# EasyEDA Pro project x_terminal.eprj, board PCB_x_terminal_2022-08-23
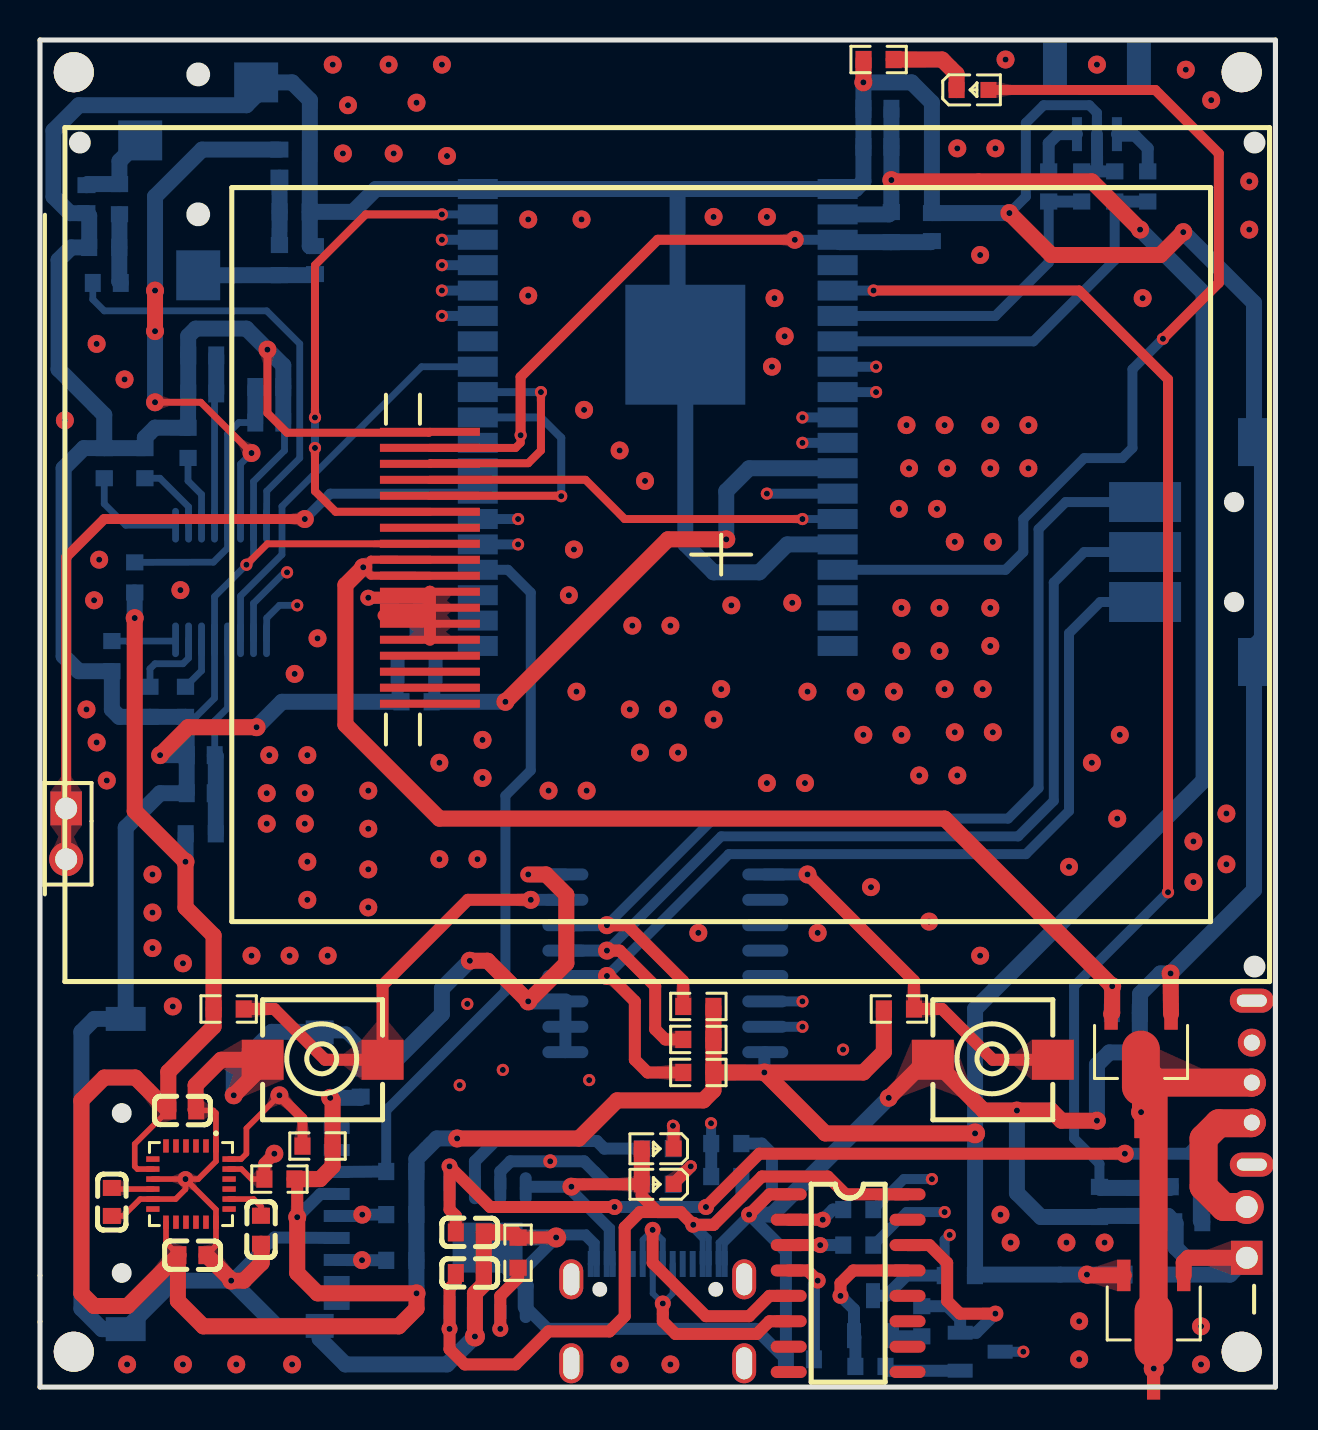
[diagram p2: board, top side]
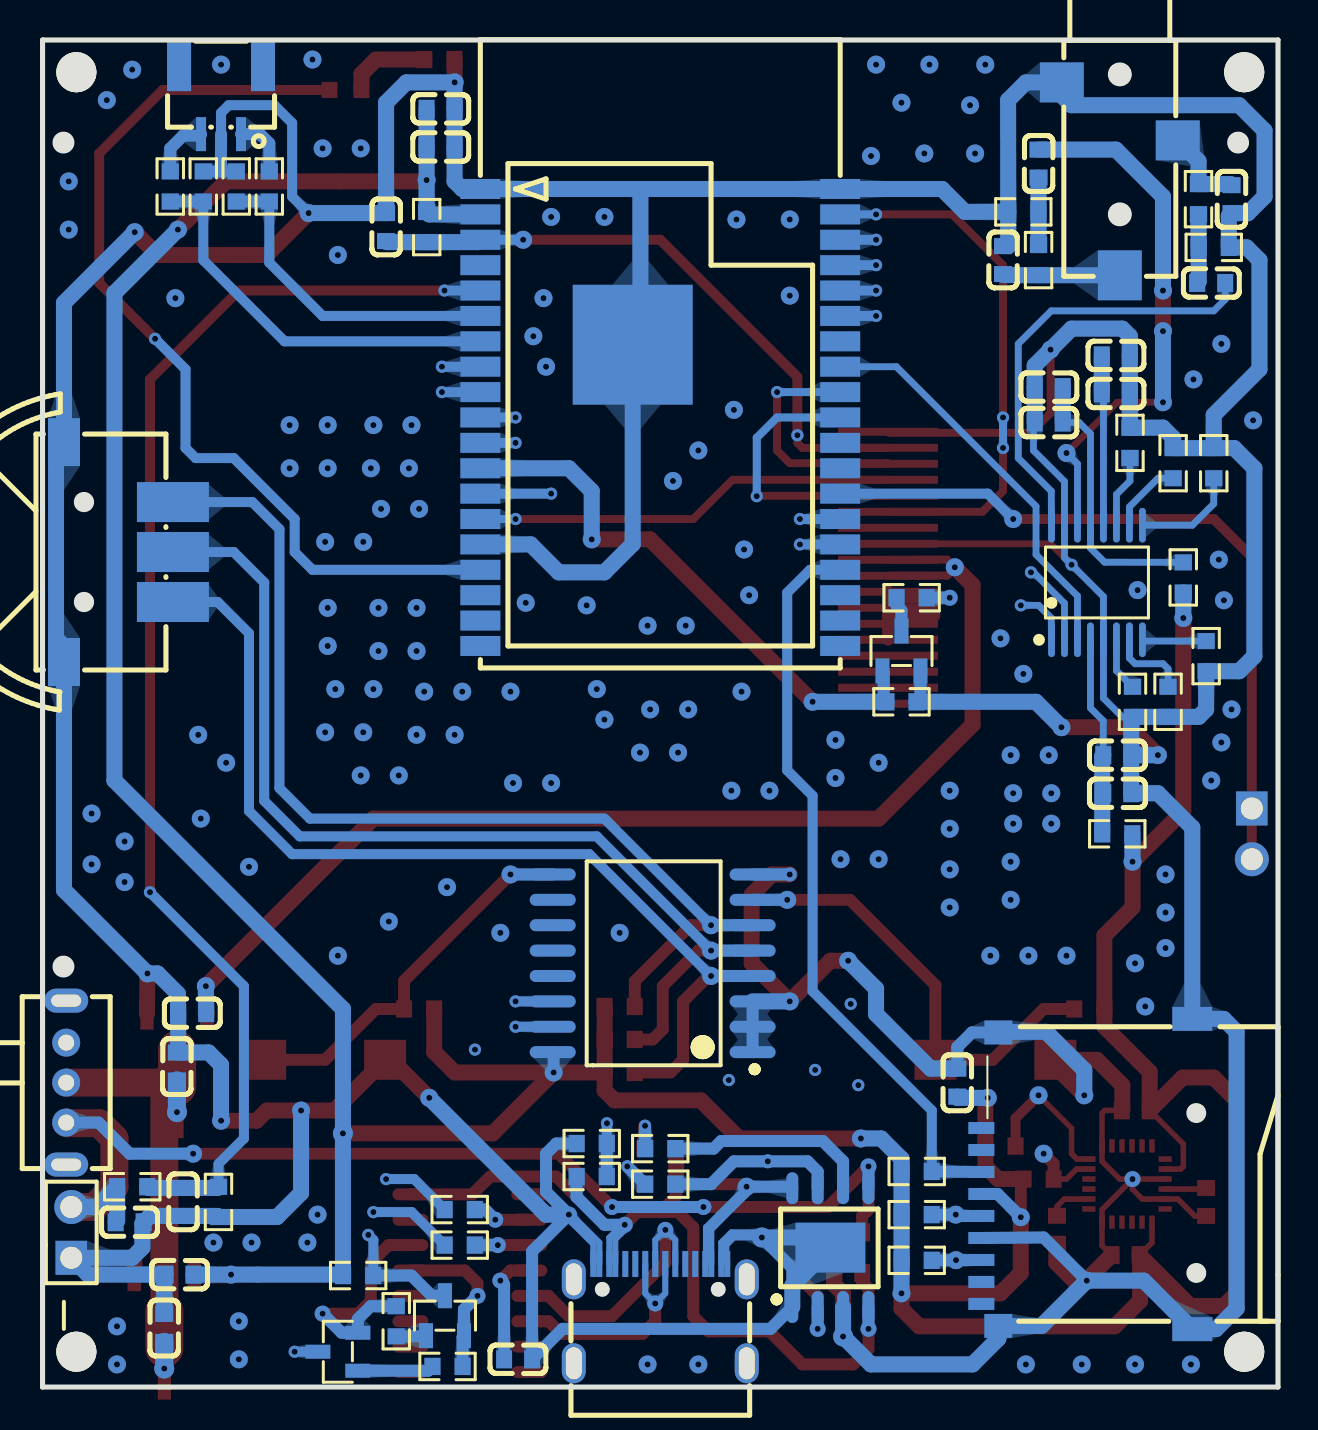
[diagram p3: board, bottom side, seen from below]

Outline 61.8 x 67.39 mm; copper layers: Top Layer, Inner1, Inner2, Bottom Layer. Coordinates in mm from the lower left corner of the outline.
Outline path: 0,3.26 0,5.59 0,67.39 61.8,67.39 61.8,0 0,0 0,3.26
Stack: Top Layer 0.035mm / Dielectric1 0.48mm PP er 4.5 / Inner1 0.035mm / Dielectric2 0.48mm FR4 er 4.5 / Inner2 0.035mm / Dielectric3 0.48mm PP er 4.5 / Bottom Layer 0.035mm

## Design rules (mm)
spacing Default (default): track to track 0.152, other pairs 0 to 0.152
track width Default (default): min 0.254, default 0.254, max 25.4
differential pair differentialPair (default): width min 0.127, default 0.254, max 2.54; gap min 0.152, default 0.152
via Default (default): diameter min 0.61, default 0.61, max 100.025; hole min 0.305, default 0.305, max 59.995
net GND uses gge6577222
pour e872 uses gge6577222

## Placement (name value [footprint] x y rotation side)
C1  100nF  [C0603]  44.62 58.03 270 bottom
C2  100nF  [C0603]  3.6 9.26 90 top
C3  10nF  [C0603]  7.12 13.84 180 top
C4  47uF  [C0603]  8.04 31.61 0 bottom
C5  2.2uF  [C0603]  41.89 62.04 0 bottom
C6  100nF  [C0603]  41.89 63.94 0 bottom
C7  47uF  [C0603]  3.34 55.23 0 bottom
C8  47uF  [C0603]  11.98 61.2 270 bottom
C9  100nF  [C0603]  2.33 59.43 90 bottom
C10  100nF  [C0603]  7.63 6.6 180 top
C12  2.2nF  [C0603]  11.05 7.87 270 top
C13  1uF  [C0603]  55.08 16.04 90 bottom
C14  10uF  [C0603]  16.04 15.23 90 bottom
C15  2.2uF  [C0603]  54.32 18.71 0 bottom
C16  100nF  [C0603]  57.44 8.24 180 bottom
C17  100nF  [C0603]  54.78 9.26 270 bottom
C18  10uF  [C0603]  21.5 5.7 0 top
C19  10uF  [C0603]  21.5 7.74 0 top
C20  1uF  [C0603]  55.71 2.96 90 bottom
C21  2.2uF  [C0603]  54.95 5.62 0 bottom
C22  100nF  [C0603]  38.01 1.39 180 bottom
C23  47uF  [C0603]  11.47 48.25 0 bottom
C30  100nF  [C0603]  8.04 29.71 0 bottom
C31  100nF  [C0603]  11.47 50.03 0 bottom
C33  100nF  [C0603]  8.11 51.61 0 bottom
C34  100nF  [C0603]  8.11 49.7 0 bottom
C37  100nF  [C0603]  13.76 56.38 270 bottom
CARD1  TF-01A  [TF-SMD_TF-01A]  9.56 10.66 90 bottom
CN1  PJ-326-3A  [AUDIO-SMD_PJ-326-3A]  7.91 60.44 180 bottom
CN2  连接器SH卧贴 1.0MM 间距 3P  [CONN-SMD_3P-P1.00_WAFER-SH1.0-3PWB]  52.87 64.38 0 bottom
J1  HDR-M-2.54_1x2  [HDR-M-2.54_1X2]  60.36 7.74 90 bottom
J2  HDR-M-2.54_1x2  [HDR-M-2.54_1X2]  1.31 27.68 270 top
LCD2  TFT_2.4_18P_SPI_ILI9341_240X320_65K_S  [ILI9341-2.4SPI]  34.08 41.65 270 top
LED1  red  [LED0603-RD]  30.9 10.15 180 top
LED2  green  [LED0603-RD]  30.9 11.93 180 top
LED3  green  [LED0603-RD]  46.65 64.89 0 top
NOREF  -  [Pad_e1905]  1.69 65.78 0 top
NOREF#2  -  [Pad_e1906]  60.11 65.78 0 top
NOREF#3  -  [Pad_e1908]  1.69 1.77 0 top
NOREF#4  -  [Pad_e1907]  60.11 1.77 90 top
Q1  S8050_C908252  [SOT-23-3_L2.9-W1.3-P1.90-LS2.4-BR]  47.03 1.77 180 bottom
Q2  S8050_C908252  [SOT-23-3_L2.9-W1.3-P1.90-LS2.4-BR]  41.67 3.57 270 bottom
Q3  S8050_C908252  [SOT-23-3_L2.9-W1.3-P1.90-LS2.4-BR]  18.84 36.82 270 bottom
R1  10K  [R0603]  32.93 15.74 0 top
R2  10K  [R0603]  32.93 17.39 180 top
R3  10K  [R0603]  32.93 19.04 180 top
R4  10K  [R0603]  44.11 3.29 270 bottom
R5  220K  [R0603]  3.21 57.01 0 bottom
R6  100R  [R0603]  3.98 59.43 270 bottom
R7  100  [R0603]  40.93 7.1 180 bottom
R8  100  [R0603]  40.93 8.88 180 bottom
R9  10K  [R0603]  46.01 5.58 180 bottom
R10  10K  [R0603]  18.07 6.34 0 bottom
R11  10K  [R0603]  18.07 10.78 0 bottom
R12  10K  [R0603]  18.07 8.62 0 bottom
R13  10K  [R0603]  41.54 1.03 180 bottom
R14  100k  [R0603]  18.84 34.28 180 bottom
R15  10  [R0603]  18.33 39.49 0 bottom
R16  1K  [R0603]  41.95 66.41 0 top
R17  47K  [R0603]  57.32 10.02 0 bottom
R18  47K  [R0603]  53 9.26 90 bottom
R19  47K  [R0603]  34.33 10.53 0 bottom
R20  47K  [R0603]  34.33 12.18 180 bottom
R21  10K  [R0603]  42.58 58.03 90 bottom
R22  4.7K  [R0603]  11.98 10.4 180 top
R23  4.7K  [R0603]  13.88 12.05 0 top
R24  100K  [R0603]  55.41 60.06 270 bottom
R25  100K  [R0603]  50.46 60.06 270 bottom
R26  20K  [R0603]  52.11 60.06 90 bottom
R27  20K  [R0603]  53.76 60.06 90 bottom
R34  10K  [R0603]  9.44 18.91 180 top
R35  10K  [R0603]  42.97 18.91 180 top
R39  1K  [R0603]  30.9 11.93 0 bottom
R40  1K  [R0603]  30.9 10.15 0 bottom
R41  1.2K  [R0603]  23.92 6.72 270 top
R44  1R  [R0603]  8.04 27.68 0 bottom
R45  1R  [R0603]  4.74 40.5 90 bottom
R46  10K  [R0603]  7.28 34.28 90 bottom
R47  10K  [R0603]  5.5 34.28 90 bottom
R48  10K  [R0603]  3.6 36.57 90 bottom
R49  10K  [R0603]  3.21 46.22 270 bottom
R50  10K  [R0603]  5.25 46.22 270 bottom
R51  10K  [R0603]  7.41 47.23 270 bottom
R53  220K  [R0603]  12.74 58.79 180 bottom
R54  100R  [R0603]  11.98 56.38 90 bottom
SW2  -  [拨轮开关三脚]  59.73 41.77 90 bottom
SW11  K2-1817UQ-C4SW-01  [KEY-SMD_2P-L6.0-W6.0-P6.00]  14.14 16.37 0 top
SW12  K2-1817UQ-C4SW-01  [KEY-SMD_2P-L6.0-W6.0-P6.00]  47.67 16.37 0 top
SW13  SK-12D07-VG3  [SW-TH_SK-12D07-VG3]  60.62 15.23 270 bottom
U1  ESP32-WROVER-I  [WIFIM-SMD_ESP32-WROVER-I]  30.9 48.5 180 bottom
U2  HT7833  [SOT-89_L4.5-W2.5-P1.50-LS4.2-BR]  55.71 4.23 90 top
U3  HT7833  [SOT-89_L4.5-W2.5-P1.50-LS4.2-BR]  55.08 17.31 90 top
U4  MPU-6050_C24112  [QFN-24_L4.0-W4.0-P0.50-BL-MPU-6050]  7.55 10.15 180 top
U7  UDA1334ATS/N2,118  [SSOP-16_L5.0-W4.4-P0.65-LS6.4-BL]  9.06 40.25 180 bottom
U9  PCF8574T  [SOP-16_L10.3-W7.5-P1.27-LS10.4-BL]  31.28 21.2 90 bottom
U10  CH340C  [SOP-16_L10.0-W3.9-P1.27-LS6.0-BL]  40.43 5.2 270 top
U14  TP4056  [SOP-8_EP_150MIL]  22.39 6.97 90 bottom
USBC1  TYPE-C-31-M-12  [USB-C_SMD-TYPE-C-31-M-12]  30.9 3.67 180 bottom

## Footprints (pads in the part's own frame, mm; a bottom-side part is the same pattern mirrored in y, then rotated)
AUDIO-SMD_PJ-326-3A
  rect 2.2x2 smd: 1(-2.9,4.825) 3(2.9,1.925)
  rect 2.2x2.5 smd: 2(0,-4.825)
C0603
  rect 0.8x0.9 smd: 1(-0.7,0) 2(0.7,0)
CONN-SMD_3P-P1.00_WAFER-SH1.0-3PWB
  rect 0.5x1.7 smd: 1(-1,1.7) 2(0,1.7) 3(1,1.7)
  rect 1.2x2.5 smd: 4(-2.1,-1.7) 5(2.1,-1.7)
HDR-M-2.54_1X2
  rect 1.7x1.575 hole 1.1: 1(-1.27,0)
  round 1.7 hole 1.1: 2(1.27,0)
ILI9341-2.4SPI
  rect 0.4x5 smd: 1(-6.14,-14.57) 2(-5.34,-14.57) 3(-4.54,-14.57) 4(-3.74,-14.57) 5(-2.94,-14.57) 6(-2.14,-14.57) 7(-1.34,-14.57) 8(-0.54,-14.57) 9(0.26,-14.57) 10(1.06,-14.57) 11(1.86,-14.57) 12(2.66,-14.57) 13(3.46,-14.57) 14(4.26,-14.57) 15(5.06,-14.57) 16(5.86,-14.57) 17(6.66,-14.57) 18(7.46,-14.57)
KEY-SMD_2P-L6.0-W6.0-P6.00
  rect 2.1x2 smd: 1(-3,0) 2(3,0)
LED0603-RD
  rect 0.8x0.8 smd: 1(-0.799,-0.004) 2(0.799,0.004)
Pad_e1905
  round 2 hole 2: 1(0,0)
Pad_e1906
  round 2 hole 2: 1(0,0)
Pad_e1907
  round 2 hole 2: 1(0,0)
Pad_e1908
  round 2 hole 2: 1(0,0)
QFN-24_L4.0-W4.0-P0.50-BL-MPU-6050
  rect 0.28x0.665 smd: 1(-1.25,-1.907) 2(-0.75,-1.907) 3(-0.25,-1.907) 4(0.25,-1.907) 5(0.75,-1.907) 6(1.25,-1.907) 13(1.25,1.907) 14(0.75,1.907) 15(0.25,1.907) 16(-0.25,1.907) 17(-0.75,1.907) 18(-1.25,1.907)
  rect 0.665x0.28 smd: 7(1.907,-1.25) 8(1.907,-0.75) 9(1.907,-0.25) 10(1.907,0.25) 11(1.907,0.75) 12(1.907,1.25) 19(-1.907,1.25) 20(-1.907,0.75) 21(-1.907,0.25) 22(-1.907,-0.25) 23(-1.907,-0.75) 24(-1.907,-1.25)
R0603
  rect 0.806x0.864 smd: 1(-0.753,0) 2(0.753,0)
SOP-8_EP_150MIL
  oval 1.6x0.6 smd: 1(-2.972,1.905) 2(-2.972,0.635) 3(-2.972,-0.635) 4(-2.972,-1.905) 5(2.972,-1.905) 6(2.972,-0.635) 7(2.972,0.635) 8(2.972,1.905)
  rect 2.5x3.5 smd: 9(0,0)
SOP-16_L10.0-W3.9-P1.27-LS6.0-BL
  oval 0.6x1.8 smd: 1(-4.445,-2.972) 2(-3.175,-2.972) 3(-1.905,-2.972) 4(-0.635,-2.972) 5(0.635,-2.972) 6(1.905,-2.972) 7(3.175,-2.972) 8(4.445,-2.972) 9(4.445,2.972) 10(3.175,2.972) 11(1.905,2.972) 12(0.635,2.972) 13(-0.635,2.972) 14(-1.905,2.972) 15(-3.175,2.972) 16(-4.445,2.972)
SOP-16_L10.3-W7.5-P1.27-LS10.4-BL
  oval 0.6x2.3 smd: 1(-4.445,-5) 2(-3.175,-5) 3(-1.905,-5) 4(-0.635,-5) 5(0.635,-5) 6(1.905,-5) 7(3.175,-5) 8(4.445,-5) 9(4.445,5) 10(3.175,5) 11(1.905,5) 12(0.635,5) 13(-0.635,5) 14(-1.905,5) 15(-3.175,5) 16(-4.445,5)
SOT-23-3_L2.9-W1.3-P1.90-LS2.4-BR
  rect 1.25x0.7 smd: 1(1,-0.95) 2(1,0.95) 3(-1,0)
SOT-89_L4.5-W2.5-P1.50-LS4.2-BR
  rect 1.575x0.672 smd: 1(1.357,-1.5) 3(1.357,1.5)
  custom 5.377x1.9 smd: 2(-1.356,0.009)
SSOP-16_L5.0-W4.4-P0.65-LS6.4-BL
  oval 0.343x1.732 smd: 1(-2.275,-2.866) 2(-1.625,-2.866) 3(-0.975,-2.866) 4(-0.325,-2.866) 5(0.325,-2.866) 6(0.975,-2.866) 7(1.625,-2.866) 8(2.275,-2.866) 9(2.275,2.865) 10(1.625,2.865) 11(0.975,2.865) 12(0.325,2.865) 13(-0.325,2.865) 14(-0.975,2.865) 15(-1.625,2.865) 16(-2.275,2.865)
SW-TH_SK-12D07-VG3
  round 1.4 hole 0.8: 1(-2,0) 2(0,0) 3(2,0)
  oval 1.2x2.2 hole 0.6x1.5: 4(4.1,0) 5(-4.1,0)
TF-SMD_TF-01A
  rect 0.6x1.3 smd: 1(2.3,5.276) 2(1.2,5.276) 3(0.101,5.276) 4(-1,5.276) 5(-2.099,5.276) 6(-3.2,5.276) 7(-4.3,5.276) 8(-5.399,5.276) 9(-6.5,5.276)
  rect 1.2x1.4 smd: 10(-7.599,4.426) 13(7.081,4.426)
  rect 1.2x2 smd: 11(-7.76,-5.276) 12(7.76,-5.276)
USB-C_SMD-TYPE-C-31-M-12
  oval 1.2x2 hole 0.8x1.6: 0(4.325,-2.484) 1(4.325,1.716) 2(-4.325,1.716) 3(-4.325,-2.484)
  rect 0.3x1.3 smd: A1(-3.35,2.484) A4(-2.55,2.484) A5(-1.25,2.484) A6(-0.25,2.484) A7(0.25,2.484) A8(1.25,2.484) A9(2.55,2.484) A12(3.35,2.484) B1(3.05,2.484) B4(2.25,2.484) B5(1.75,2.484) B6(0.75,2.484) B7(-0.75,2.484) B8(-1.75,2.484) B9(-2.25,2.484) B12(-3.05,2.484)
WIFIM-SMD_ESP32-WROVER-I
  rect 2x1 smd: 1(-9,11.43) 2(-9,10.16) 3(-9,8.89) 4(-9,7.62) 5(-9,6.35) 6(-9,5.08) 7(-9,3.81) 8(-9,2.54) 9(-9,1.27) 10(-9,0) 11(-9,-1.27) 12(-9,-2.54) 13(-9,-3.81) 14(-9,-5.08) 15(-9,-6.35) 16(-9,-7.62) 17(-9,-8.89) 18(-9,-10.16) 19(-9,-11.43) 20(9,-11.43) 21(9,-10.16) 22(9,-8.89) 23(9,-7.62) 24(9,-6.35) 25(9,-5.08) 26(9,-3.81) 27(9,-2.54) 28(9,-1.27) 29(9,0) 30(9,1.27) 31(9,2.54) 32(9,3.81) 33(9,5.08) 34(9,6.35) 35(9,7.62) 36(9,8.89) 37(9,10.16) 38(9,11.43)
  rect 6x6 smd: 39(-1.38,3.64)
拨轮开关三脚
  rect 2x3.6 smd: 1(-2.5,-4.45) 2(0,-4.45) 3(2.5,-4.45)
  rect 2.4x1.6 smd: 4(-5.5,1) 5(5.5,1)

## Nets
3V3: C3.2 C5.2 C6.2 C10.2 C14.1 C21.1 CARD1.4 R1.2 R2.1 R3.1 R9.1 R10.2 R11.2 R12.2 R21.2 R22.1 R23.2 R34.2 R35.2 R44.1 R45.1 U1.2 U2.3 U4.8 U4.13 U9.16
3V3_LCD: C15.1 LCD2.9 LCD2.10 U3.3
GND: C1.1 C2.1 C3.1 C4.1 C5.1 C6.1 C9.1 C10.1 C12.2 C13.2 C14.2 C15.2 C16.2 C17.2 C18.2 C19.2 C20.2 C21.2 C22.2 C23.2 C30.1 C31.2 C33.1 C34.1 C37.1 CARD1.6 CARD1.10 CARD1.11 CARD1.12 CARD1.13 CN1.1 CN2.2 J1.1 LCD2.1 LCD2.8 Q3.2 R5.1 R14.2 R16.1 R18.1 R20.1 R26.2 R27.2 R41.1 R46.1 R47.1 R48.1 R49.1 R50.1 R51.1 R53.1 SW2.4 SW2.5 SW11.1 SW12.1 U1.1 U1.15 U1.38 U1.39 U2.1 U3.1 U4.1 U4.9 U4.11 U4.18 U7.5 U7.15 U9.1 U9.2 U9.3 U9.8 U10.1 U14.1 U14.3 U14.9 USBC1.A1 USBC1.A12 USBC1.B1 USBC1.B12
VBAT_S: C17.1 R17.1 R18.2 U1.5
VIN: C13.1 C20.1 SW13.2 U2.2 U3.2
ADC1_CH6: R25.2 R26.1 U1.6
ADC1_CH7: R24.2 R27.1 U1.7
BACK_KEY: R35.1 SW12.2 U9.9
C34_2: C33.2 C34.2 U7.12
CHRG_STAT: R40.1 U1.9 U14.7
D+: U10.5 USBC1.A6 USBC1.B6
D-: U10.6 USBC1.A7 USBC1.B7
DOWN_KEY: R3.2 SW2.3 U9.6
DTR: Q2.2 R13.2 U10.13
I2C_SCL: R22.2 U1.36 U4.23 U9.14
I2C_SDA: R23.1 U1.33 U4.24 U9.15
I2S_BCK: U1.11 U7.1
I2S_DIN: U1.31 U7.3
I2S_LCK: U1.10 U7.2
IO0: Q2.3 R9.2 U1.25
LCD_BCKL: Q3.1 R14.1 U1.12
LCD_CS: LCD2.5 U1.29
LCD_DC: LCD2.4 U1.14
LCD_MOSI: LCD2.6 U1.37
LCD_SCK: LCD2.3 U1.30
LDAC: C37.2 CN1.2 R54.1
LED1_1: LED1.1 R40.2
LED2_1: LED2.1 R39.2
LED3_2: LED3.2 U1.16
MENU_KEY: R34.1 SW11.2 U9.7
Q1_1: Q1.1 R13.1
Q2_1: Q2.1 R4.2
Q3_3: Q3.3 R15.2
R5_2: C7.2 R5.2 R6.2
R7_2: R7.2 U10.3
R8_2: R8.2 U10.2
R15_1: LCD2.11 LCD2.12 LCD2.13 LCD2.14 R15.1
R16_2: LED3.1 R16.2
R24_1: CN2.3 R24.1
R25_1: CN2.1 R25.1
R39_1: R39.1 U14.6
R41_2: R41.2 U14.2
R44_2: C4.2 C30.2 R44.2 U7.4
R45_2: C23.1 C31.1 R45.2 U7.13
R46_2: R46.2 U7.6
R47_2: R47.2 U7.7
R48_2: R48.2 U7.8
R49_2: R49.2 U7.9
R50_2: R50.2 U7.10
R51_2: R51.2 U7.11
R54_2: C8.2 R53.2 R54.2
RDAC: C9.2 CN1.3 R6.1
RESET: C1.2 LCD2.2 Q1.3 R21.1 U1.3
RTS: Q1.2 R4.1 U10.14
RX: R7.1 U1.35
SD_CLK: CARD1.5 R12.1 U1.13
SD_CMD: CARD1.3 R11.1 U1.23
SD_DAT0: CARD1.7 R10.1 U1.24
SELECT_KEY: R2.2 SW2.2 U9.5
TOUCH_SWITCH: J2.1 J2.2 U1.26
TX: R8.1 U1.34
U4_10: C2.2 U4.10
U4_20: C12.1 U4.20
U7_14: C8.1 U7.14
U7_16: C7.1 U7.16
U10_4: C22.1 U10.4
UP_KEY: R1.1 SW2.1 U9.4
USB_DET: R19.1 R20.2 U1.8
V_BATT: C16.1 C19.1 J1.2 R17.2 SW13.3 U14.5
V_USB: C18.1 LED1.2 LED2.2 R19.2 U10.16 U14.4 U14.8 USBC1.A4 USBC1.A9 USBC1.B4 USBC1.B9

Pads without a net: CARD1 1 2 8 9; CN2 4 5; LCD2 7 15 16 17 18; NOREF 1; NOREF#2 1; NOREF#3 1; NOREF#4 1; SW13 1 4 5; U1 4 17 18 19 20 21 22 27 28 32; U4 2 3 4 5 6 7 12 14 15 16 17 19 21 22; U9 10 11 12 13; U10 7 8 9 10 11 12 15; USBC1 0 1 2 3 A5 A8 B5 B8

## Via types
v1: diameter 0.9, hole 0.305, Top Layer to Bottom Layer, 183 vias
v2: diameter 0.7, hole 0.305, Top Layer to Bottom Layer, 2 vias
v3: diameter 0.8, hole 0.305, Top Layer to Bottom Layer, 16 vias
v4: diameter 1, hole 0.305, Top Layer to Bottom Layer, 5 vias
v5: diameter 0.61, hole 0.305, Top Layer to Bottom Layer, 38 vias

## Routing (per net, layer and track width the routed paths; a pad name or vN(x,y) marks a point on that pad's centre or on a via; arc(x,y) is an arc through that point)
3V3: length 234.5
  Top Layer w0.28: C10.2 6.3,7.22 6.3,8.25 ; U4.8 4.87,10.9 4.74,11.04 4.74,12.16 C3.2
  Top Layer w0.6: R22.1 12.87,10.27 v1(12.87,8.5)
  Top Layer w0.8: v1(36.23,15.74) 41.19,15.74 42.21,16.76 R35.2 ; v1(36.23,15.74) R1.2 ; v1(36.23,15.74) 39.28,12.69 v4(46.78,12.69) ; R1.2 R2.1 R3.1 ; R1.2 33.69,14.84 33.19,14.34 28.87,14.34 26.96,12.44 v1(20.87,12.44) ; 42.59,60.38 42.65,60.31 52.62,60.31 v1(55.03,57.9) ; 12.73,10.4 14.01,10.4 14.64,11.05 R23.2 14.64,14.35 v1(14.52,14.47) ; U2.3 52.41,5.58 v1(52.37,5.62) ; v1(4.74,38.47) 4.74,28.82 v1(7.28,26.28) 7.28,23.99 8.68,22.59 8.68,18.03 6.42,15.77 6.42,13.84 4.77,15.48 3.21,15.48 2.07,14.34 2.07,4.69 2.71,4.05 4.38,4.05 C10.2 6.9,6.57 6.9,4.31 8.17,3.04 17.95,3.04 18.84,3.93 v1(18.84,4.69) 13.88,4.69 12.87,5.7 v1(12.87,8.5)
  Bottom Layer w0.6: v1(12.87,8.5) 14.03,9.66 14.84,9.66 ; 36.28,16.75 36.23,16.71 v1(36.23,15.74)
  Bottom Layer w0.8: 42.59,62.04 v1(42.59,60.38) R21.2 42.47,58.66 39.9,58.66 ; 46.78,5.58 v4(46.78,12.69) 46.78,18.91 58.21,30.34 58.21,54.73 v1(55.03,57.9) ; v1(52.37,5.62) C21.1 ; v1(14.52,14.47) 16.04,14.47 C14.1 ; v1(20.87,12.44) 19.85,12.44 18.83,11.41 18.83,10.78 ; R45.1 v1(4.74,38.47) ; R11.2 R10.2 ; R44.1 v1(7.28,26.28) ; 52.37,5.63 46.81,5.63 46.77,5.58 ; C6.2 C5.2 ; 18.83,6.34 v1(18.84,4.69)
3V3_LCD: length 61.8
  Top Layer w0.4: 19.51,41.39 16.55,41.39 v1(16.17,41.01) 16.55,40.59 19.51,40.59
  Top Layer w0.8: v1(16.17,41.01) 15.28,40.12 15.28,33.14 19.98,28.44 45.25,28.44 v1(53.63,20.06) 53.63,18.72 U3.3
  Bottom Layer w0.8: C15.1 v1(53.63,20.06)
GND: length 528.2
  Top Layer w0.28: v3(7.28,10.4) 7.28,9.9 6.79,9.4 U4.11 5.01,9.41 4.16,8.56 3.6,8.56 ; v3(7.28,10.4) 8.8,8.88 8.8,7.08 C10.1 ; v3(7.28,10.4) 7.91,10.4 8.8,11.29 U4.1 8.8,13.7 8.67,13.84 C3.1 ; v3(7.28,10.4) 5.65,10.41
  Top Layer w0.34: v5(10.33,41.14) 11.38,42.19 19.51,42.19
  Top Layer w0.4: v1(11.38,51.9) 11.38,48.72 12.36,47.74 19.46,47.74 19.51,47.79
  Top Layer w0.6: U10.1 36.49,9.64 v3(35.47,8.62) ; R41.1 v4(25.82,7.48)
  Top Layer w0.8: 21.76,2.91 21.76,4.69 22.2,5.13 C18.2 C19.2 23.65,7.74 R41.1 ; v1(52.87,13.32) 51.09,13.32 50.59,13.83 v1(48.87,13.83) 47.2,13.83 SW12.1 44.36,16.37 v1(42.46,14.47) ; v1(10.83,33.01) 7.41,33.01 v1(6.01,31.61) ; 56.58,18.67 v1(56.55,20.69) ; C3.1 7.79,13.87 7.79,15.1 9.06,16.37 SW11.1 11.14,16.04 v1(9.69,14.59) ; v1(48.49,58.73) 50.59,56.63 56.05,56.63 v1(57.19,57.77) ; v2(24.42,25.64) 25.31,25.64 26.33,24.63 26.33,21.2 v1(24.42,19.29) 22.39,21.33 v1(21.5,21.33) ; 41.2,66.41 v1(41.19,65.27) ; C10.1 9.56,5.36 v1(9.56,5.32) 10.2,5.32 11.09,6.21 11.09,7.13 11.05,7.17 ; J1.1 57.44,6.47 57.21,6.24 U2.1
  Bottom Layer w0.3: USBC1.B1 27.85,7.23 27.34,7.74 26.08,7.74 v4(25.82,7.48) 27.22,7.48 27.6,7.1 27.6,6.2 USBC1.A12 ; USBC1.A1 34.25,7.15 35.47,8.37 v3(35.47,8.62) 35.35,8.62 33.95,7.23 USBC1.B12
  Bottom Layer w0.34: 12.17,48.25 12.23,48.19 12.23,46.85 10.68,45.3 10.68,41.49 v5(10.33,41.14) 8.73,39.54 8.73,34.46 7.79,33.52 7.28,33.52
  Bottom Layer w0.5: CN2.2 52.87,63.74 52.49,64.12 50.2,64.12 49.32,63.23 49.32,59.55 v1(48.49,58.73)
  Bottom Layer w0.6: v4(25.82,7.48) 24.3,5.96 U14.1 25.39,2.91 35.79,2.91 C22.2 37.31,6.78 v3(35.47,8.62) 36.62,9.77 36.62,11.67 36.11,12.18 35.08,12.18 ; Q3.2 17.89,34.48 R14.2 ; 14.84,7.46 11.72,7.48 v1(9.56,5.32) ; U9.3 26.28,16.75 ; 52.87,62.68 52.88,60.81 ; R26.2 R27.2 ; 13.99,17.74 15.31,17.74 16.04,17.01 16.04,15.93 ; U9.8 v2(24.42,25.64)
  Bottom Layer w0.8: v1(24.42,19.29) U9.3 ; v1(6.01,31.61) C4.1 ; C14.2 17.38,15.93 20.11,18.66 20.11,19.93 v1(21.5,21.33) ; C31.2 C23.2 ; v4(25.82,7.48) 22.9,7.48 U14.9 24.3,5.07 U14.1 ; R14.2 12.11,34.28 v1(10.83,33.01) ; 3.6,35.81 1.94,35.81 1.18,36.57 1.18,45.96 2.19,46.97 3.21,46.97 ; v3(35.47,8.62) 36.62,8.62 v1(42.46,14.47) ; 55.65,5.63 59.52,5.63 J1.1 57.32,6.47 56.81,6.97 56.81,8.18 56.74,8.24 ; v1(48.49,58.73) C1.1 44.62,64.25 43.6,65.27 v1(41.19,65.27) C6.1 C5.1 ; C16.2 56.43,8.56 C17.2 53.05,8.56 R18.1 50.07,8.51 48.87,9.71 v1(48.87,13.83) ; R53.1 15.66,58.79 16.8,59.93 U1.38 U1.1 40.81,59.93 41.19,60.32 41.19,62.04 ; 55.02,18.71 55.03,19.67 56.05,20.69 v1(56.55,20.69) 60.73,24.87 SW2.4 ; v1(57.19,57.77) 60.73,54.23 SW2.5 ; v1(9.69,14.59) 9.69,15.86 11.6,17.77 13.96,17.77 CARD1.13 ; 5.25,46.97 5.25,47.49 5.75,48 7.41,47.99 7.41,49.7 ; C20.2 55.71,5.56 55.65,5.62 ; 31.9,59.93 31.9,52.53 U1.39 32.28,42.17 33.7,40.76 35.98,40.76 37.38,42.15 U1.15 ; 60.73,47.27 61.13,46.88 61.13,37.45 60.73,37.06 60.73,36.27 ; C33.1 C34.1 ; 7.41,51.61 7.41,52.57 7.79,52.95 10.33,52.95 v1(11.38,51.9) 12.17,51.1 12.17,50.03 ; U14.3 v4(21.76,2.53) 20.36,1.13 15.28,1.13 13.99,2.42 CARD1.10 11.83,3.06 v1(9.56,5.32) 6.71,5.32 CARD1.11 ; 13.76,57.08 13.49,57.08 13.49,58.79 13.5,64.38 12.61,65.27 10.81,65.27 10.81,64.61 10.33,64.12 1.94,64.12 0.67,62.85 0.67,59.55 1.5,58.72 C9.1 2.46,58.59 R5.1 1.56,57.01 0.93,56.38 0.93,50.92 3.21,48.63 R49.1 R50.1 ; v1(52.87,13.32) 52.87,16.12 53.49,16.74 C13.2 55.02,16.8 C15.2 ; R48.1 3.6,33.9 3.97,33.53 R47.1 R46.1 7.34,33.46 C30.1 6.01,29.71 4.29,27.99 4.29,18.42 2.72,18.42 2.07,17.77 2.07,3.93 3.1,2.9 4.29,2.9
  vias: v1(1.25,48.36) v1(2.33,33.9) v1(2.71,39.36) v1(2.83,52.19) v1(2.83,32.25) v1(2.96,41.39) v1(3.34,30.34) v1(4.23,50.41) v1(4.36,1.13) v1(5.63,25.64) v1(5.63,23.74) v1(5.63,21.96) v1(6.64,19.04) v1(7.02,39.87) v1(7.15,21.2) v1(7.15,1.13) v1(9.82,1.13) v1(10.58,21.58) v1(11.34,29.71) v1(11.34,28.18) v1(11.47,31.61) v1(12.49,21.58) v1(12.61,1.13) v1(12.74,35.68) v1(13.25,29.71) v1(13.25,28.18) v1(13.37,31.61) v1(13.37,26.28) v1(13.37,24.37) v1(13.88,37.45) v1(14.39,21.58) v1(14.64,66.16) v1(15.15,61.71) v1(15.41,64.12) v1(16.42,29.83) v1(16.42,27.93) v1(16.42,25.9) v1(16.42,23.99) v1(17.44,66.16) v1(17.69,61.71) v1(18.84,64.25) v1(19.98,31.23) v1(19.98,26.41) v1(20.11,66.16) v1(20.36,61.58) v1(21.88,26.41) v1(22.14,32.37) v1(22.14,30.47) v1(24.42,58.41) v1(24.42,54.6) v1(25.44,29.83) v1(26.46,39.61) v1(26.71,41.9) v1(26.84,34.79) v1(27.09,58.41) v1(27.22,48.88) v1(27.34,29.83) v1(29,46.85) v1(29,1.13) v1(29.5,33.9) v1(29.63,38.09) v1(30.01,31.74) v1(30.27,45.33) v1(31.41,33.9) v1(31.54,38.09) v1(31.54,1.13) v1(31.92,31.74) v1(32.93,22.72) v1(33.7,58.54) v1(33.7,33.39) v1(34.08,34.91) v1(34.58,39.11) v1(36.36,58.54) v1(36.36,30.22) v1(36.62,51.04) v1(36.74,54.47) v1(37.25,52.57) v1(37.63,39.23) v1(38.27,30.22) v1(38.39,34.79) v1(38.9,22.72) v1(40.81,34.79) v1(41.19,32.63) v1(41.57,25.01) v1(42.71,34.79) v1(42.97,43.93) v1(43.09,38.98) v1(43.09,36.82) v1(43.09,32.63) v1(43.35,48.12) v1(43.47,45.96) v1(43.98,30.6) v1(44.48,23.29) v1(44.87,43.93) v1(45,38.98) v1(45,36.82) v1(45.25,48.12) v1(45.25,34.91) v1(45.38,45.96) v1(45.76,42.28) v1(45.76,32.76) v1(45.89,61.97) v1(45.89,30.6) v1(47.03,56.63) v1(47.03,21.58) v1(47.16,34.91) v1(47.54,48.12) v1(47.54,45.96) v1(47.54,38.98) v1(47.54,37.07) v1(47.67,42.28) v1(47.67,32.76) v1(47.79,61.97) v1(48.05,8.62) v1(48.3,66.41) v1(48.55,7.23) v1(49.44,48.12) v1(49.44,45.96) v1(51.35,7.23) v1(51.48,26.02) v1(51.98,3.29) v1(51.98,1.39) v1(52.62,31.23) v1(52.87,66.16) v1(53.25,7.23) v1(53.89,28.44) v1(54.02,32.63) v1(55.16,54.47) v1(57.32,65.9) v1(57.7,27.29) v1(57.7,25.26) v1(58.08,3.04) v1(58.08,1.13) v1(58.59,64.38) v1(59.35,28.69) v1(59.35,26.15) v1(60.49,60.31) v1(60.49,57.9)
VBAT_S: length 64.8
  Top Layer w0.5: v5(41.7,54.85) 51.98,54.85 56.43,50.41 v5(56.43,24.75)
  Bottom Layer w0.5: U1.5 v5(41.7,54.85) ; R18.2 53,11.17 51.73,12.44 51.73,20.06 v5(56.43,24.75)
  Bottom Layer w0.8: R18.2 53.05,9.96 C17.1 56.5,9.96 R17.1
VIN: length 28.5
  Top Layer w0.9: 55.08,15.94 U3.2 55.08,15.94 ; 55.08,15.94 v4(55.08,13.75) 55.08,15.94 ; v4(55.71,0.93) U2.2
  Top Layer w1.4: SW13.2 55.79,15.23 U3.2 55.71,15.32 U2.2
  Bottom Layer w0.9: v4(55.08,13.75) C13.1 ; C20.1 v4(55.71,0.93)
ADC1_CH6: length 16.4
  Bottom Layer w0.5: U1.6 47.79,53.58 50.46,56.25 R25.2
  Bottom Layer w0.6: R25.2 52.11,59.31
ADC1_CH7: length 20.1
  Bottom Layer w0.5: U1.7 49.7,52.31 53.76,56.38 53.76,59.31
  Bottom Layer w0.6: 53.76,59.31 R24.2
BACK_KEY: length 19
  Top Layer w0.6: v1(38.39,25.64) 43.72,20.32 R35.1 ; 43.72,18.91 45.12,18.91 47.67,16.37 SW12.2
  Bottom Layer w0.6: 36.28,25.64 v1(38.39,25.64)
C34_2: length 8.5
  Bottom Layer w0.34: C34.2 8.73,49.62 U7.12
  Bottom Layer w0.8: C33.2 C34.2
CHRG_STAT: length 76.1
  Inner1 w0.5: v5(27.47,15.36) 25.44,13.32 25.44,11.38 v2(25.52,11.29)
  Inner2 w0.5: v5(27.47,15.36) 33.19,21.07 40.3,21.07 54.02,34.79 54.02,47.74 51.98,49.77 v5(41.82,49.77)
  Bottom Layer w0.5: U1.9 v5(41.82,49.77)
  Bottom Layer w0.6: R40.1 28.36,10.15 27.22,11.29 v2(25.52,11.29) 23.53,11.29 23.03,10.78 U14.7
D+: length 13.8
  Top Layer w0.6: U10.5 36.49,4.56 35.47,3.55 33.31,3.55 30.65,6.21 v3(30.65,7.86)
  Bottom Layer w0.3: 31.15,6.16 31.15,7.36 v3(30.65,7.86) 30.15,7.37 USBC1.B6
D-: length 12.1
  Top Layer w0.6: v3(31.15,4.18) 31.15,3.29 31.79,2.66 35.85,2.66 36.49,3.29 U10.6
  Bottom Layer w0.3: USBC1.B7 31.65,4.68 v3(31.15,4.18) 30.65,4.68 30.65,6.16
DOWN_KEY: length 51.6
  Top Layer w0.6: R3.2 32.17,20.31 29.38,23.1 v1(28.36,23.1)
  Bottom Layer w0.5: v1(28.36,23.1) 33.7,28.44 48.43,28.44 49.95,29.96 49.95,42.92 51.31,44.27 SW2.3
  Bottom Layer w0.6: v1(28.36,23.1) U9.6
DTR: length 8.1
  Top Layer w0.6: 43.4,5.83 40.68,5.83 40.05,5.2 v3(40.05,4.56)
  Bottom Layer w0.6: R13.2 40.79,2.5 Q2.2 40.72,3.89 v3(40.05,4.56)
I2C_SCL: length 97
  Top Layer w0.28: 11.22,10.4 10.58,10.4 10.08,10.9 U4.23
  Top Layer w0.6: R22.2 11.22,11.17 v1(11.72,11.67)
  Inner1 w0.5: v5(38.14,19.29) 39.03,18.4 39.03,17.52 38.27,16.75 18.84,16.75 13.76,11.67 v1(11.72,11.67) 9.82,11.67 8.3,13.2 8.3,53.96 11.72,57.39 v5(20.11,57.39)
  Bottom Layer w0.5: U9.14 v5(38.14,19.29) ; U1.36 v5(20.11,57.39)
I2C_SDA: length 89
  Top Layer w0.28: U4.24 10.06,11.4 10.33,11.67 10.33,12.94 v1(11.98,14.59)
  Top Layer w0.5: R23.1 13.13,13.44 v1(11.98,14.59)
  Inner1 w0.5: 9.31,38.22 9.31,17.26 v1(11.98,14.59) 15.41,18.02 v5(38.14,18.02) ; 9.31,38.22 9.31,52.06 10.83,53.58 v5(20.11,53.58) ; 9.31,38.22 9.44,38.34
  Bottom Layer w0.5: U1.33 v5(20.11,53.58) ; U9.15 v5(38.14,18.02)
I2S_BCK: length 42.4
  Inner1 w0.34: v5(38.14,47.23) 32.04,47.23 27.98,51.3 15.28,51.3 14.39,50.41 14.39,40.63 v5(12.87,39.11)
  Bottom Layer w0.34: 11.33,37.38 11.34,38.47 11.98,39.11 v5(12.87,39.11)
  Bottom Layer w0.5: v5(38.14,47.23) U1.11
I2S_DIN: length 20.2
  Bottom Layer w0.34: 10.03,37.38 10.03,39.57 12.11,41.65 12.11,44.06 19.09,51.04 U1.31
I2S_LCK: length 44.3
  Inner1 w0.34: v5(12.36,40.76) 11.98,41.14 11.98,50.28 14.14,52.44 28.74,52.44 32.68,48.5 v5(38.14,48.5)
  Bottom Layer w0.34: v5(12.36,40.76) 12.23,40.76 10.68,39.21 U7.2
  Bottom Layer w0.5: v5(38.14,48.5) U1.10
IO0: length 53.4
  Inner1 w0.5: v5(23.92,43.42) 25.06,42.28 25.06,34.03 44.11,14.98 44.11,12.44 46.14,10.4 46.14,8.24 v5(45.51,7.61)
  Bottom Layer w0.5: v5(45.51,7.61) 45.25,7.36 45.26,5.58 ; U1.25 v5(23.92,43.42)
  Bottom Layer w0.6: R9.2 43.35,5.58 42.34,4.57 Q2.3
LCD_BCKL: length 28.3
  Top Layer w0.8: v1(34.33,42.41) 31.41,42.41 v1(23.28,34.28)
  Bottom Layer w0.6: 19.79,35.82 19.73,35.76 19.73,34.28 19.59,34.28
  Bottom Layer w0.8: R14.1 v1(23.28,34.28) ; 39.9,45.96 35.47,45.96 34.33,44.82 v1(34.33,42.41)
LCD_CS: length 14.1
  Top Layer w0.4: 19.51,44.59 26.06,44.59 v5(26.08,44.57)
  Bottom Layer w0.4: U1.29 25.06,48.5 26.08,47.49 v5(26.08,44.57)
LCD_DC: length 21.2
  Top Layer w0.4: v5(38.14,43.42) 29.25,43.42 27.29,45.39 19.51,45.39
  Bottom Layer w0.4: U1.14 v5(38.14,43.42)
LCD_MOSI: length 26.7
  Top Layer w0.4: v5(20.11,58.66) 16.3,58.66 13.76,56.12 v5(13.76,48.5) ; 19.51,43.79 14.79,43.79 13.76,44.82 v5(13.76,46.98)
  Bottom Layer w0.4: v5(20.11,58.66) 21.9,58.66 ; v5(13.76,46.98) v5(13.76,48.5)
LCD_SCK: length 11.9
  Top Layer w0.4: v5(25.06,49.77) 25.06,46.85 24.42,46.22 19.54,46.22 19.51,46.18
  Bottom Layer w0.4: U1.30 v5(25.06,49.77)
LDAC: length 5.9
  Bottom Layer w0.8: CN1.2 11.98,55.62 ; R54.1 13.7,55.62 C37.2
LED1_1: length 2.5
  Top Layer w0.6: LED1.1 31.7,10.19 v5(32.55,11.04)
  Bottom Layer w0.6: v5(32.55,11.04) 31.66,10.15 R40.2
LED2_1: length 2.3
  Top Layer w0.6: v5(31.66,13.07) 31.7,13.03 LED2.1
  Bottom Layer w0.6: R39.2 v5(31.66,13.07)
LED3_2: length 47.6
  Top Layer w0.5: 47.45,64.89 55.79,64.89 58.97,61.71 58.97,55.23 v5(56.17,52.44)
  Bottom Layer w0.5: v5(56.17,52.44) 54.65,50.92 54.65,46.98 54.14,46.47 52.24,46.47 49.19,43.42 49.19,41.77 48.3,40.88 39.9,40.88
MENU_KEY: length 22.6
  Top Layer w0.6: v1(24.55,24.37) 21.41,24.37 17.14,20.1 SW11.2 14.26,16.37 11.72,18.91 10.19,18.91
  Bottom Layer w0.6: U9.7 v1(24.55,24.37)
Q1_1: length 3.8
  Bottom Layer w0.6: R13.1 42.51,0.82 Q1.1
Q2_1: length 1.5
  Bottom Layer w0.6: Q2.1 42.65,2.54 R4.2
Q3_3: length 1.8
  Bottom Layer w0.6: R15.2 19.08,39.1 18.84,38.85 Q3.3
R5_2: length 3.5
  Bottom Layer w0.8: 3.98,58.67 R5.2 3.97,55.31 C7.2
R7_2: length 2.7
  Top Layer w0.6: U10.3 v3(39.03,7.1)
  Bottom Layer w0.6: R7.2 v3(39.03,7.1)
R8_2: length 2.9
  Top Layer w0.6: U10.2 v3(39.16,8.37)
  Bottom Layer w0.6: v3(39.16,8.37) 39.66,8.88 R8.2
R15_1: length 9.1
  Top Layer w0.6: v3(16.42,39.49) 19.21,39.49 19.51,39.79 19.51,37.39 ; 19.51,38.59 17.18,38.6
  Bottom Layer w0.6: v3(16.42,39.49) R15.1
R16_2: length 4.2
  Top Layer w0.8: LED3.1 45.85,65.69 45.12,66.41 R16.2
R24_1: length 3
  Bottom Layer w0.6: 55.41,60.81 55.41,61.97 54.78,62.6 53.95,62.6 CN2.3
R25_1: length 3
  Bottom Layer w0.6: CN2.1 50.92,62.68 50.46,62.22 50.46,60.81
R39_1: length 10.3
  Bottom Layer w0.6: U14.6 21.76,11.29 22.77,12.31 27.85,12.31 28.23,11.93 30.15,11.93
R41_2: length 4.5
  Top Layer w0.6: R41.2 23.92,5.45 23.03,4.56 v3(23.03,2.91)
  Bottom Layer w0.6: v3(23.03,2.91) U14.2
R44_2: length 10
  Bottom Layer w0.34: 9.38,37.38 9.38,33.97 8.74,33.33 C4.2
  Bottom Layer w0.8: C4.2 8.79,31.56 R44.2
R45_2: length 14
  Bottom Layer w0.34: R45.2 8.68,41.26 9.38,41.97 9.38,43.11 ; C23.1 9.95,48.25 9.38,47.69 U7.13
  Bottom Layer w0.8: C31.1 C23.1
R46_2: length 2.7
  Bottom Layer w0.34: R46.2 8.08,35.84 8.08,37.38
R47_2: length 4
  Bottom Layer w0.34: U7.7 7.43,36.46 7.15,36.18 5.75,36.18 5.5,35.93 R47.2
R48_2: length 3.2
  Bottom Layer w0.34: U7.8 6.72,37.32 R48.2
R49_2: length 5.3
  Bottom Layer w0.34: R49.2 3.21,44.19 4.29,43.11 U7.9
R50_2: length 3.7
  Bottom Layer w0.34: 5.25,45.46 6,45.46 7.43,44.03 7.43,43.11
R51_2: length 3.6
  Bottom Layer w0.34: 8.08,43.11 8.08,44.65 7.41,45.33 R51.2
R54_2: length 3.4
  Bottom Layer w0.8: 11.98,60.5 11.99,58.79 11.98,57.13
RDAC: length 4.3
  Bottom Layer w0.8: 2.33,60.12 2.38,60.18 R6.1 ; 3.98,60.18 3.98,61.33 CN1.3
RESET: length 90.7
  Top Layer w0.4: v5(24.04,47.61) 24.04,47.23 23.79,46.98 19.51,46.98
  Top Layer w0.5: v1(37.76,57.39) 30.9,57.39 24.04,50.54 v5(24.04,47.61)
  Inner1 w0.5: v5(49.19,1.77) 49.95,2.53 49.95,21.33 28.11,43.17 28.11,45.58 26.08,47.61 v5(24.04,47.61)
  Bottom Layer w0.5: U1.3 v1(37.76,57.39) ; 48.03,1.77 v5(49.19,1.77)
  Bottom Layer w0.8: C1.2 44.56,57.28 40.02,57.28 U1.3
RTS: length 12
  Top Layer w0.6: v3(47.79,3.67) 46.01,3.67 45.38,4.31 45.38,6.21 44.49,7.1 U10.14
  Bottom Layer w0.6: v3(47.79,3.67) 46.84,2.72 Q1.2 46.03,3.4 45.39,4.04 R4.1
RX: length 87.8
  Inner2 w0.5: v5(20.11,56.12) 16.04,56.12 15.03,55.11 15.03,23.36 16.04,22.34 16.04,12.31 18.58,9.77 21.76,9.77 24.55,12.56 27.47,12.56 28.11,11.93 38.52,11.93 41.7,8.75 v5(45.25,8.75)
  Bottom Layer w0.5: v5(20.11,56.12) U1.35 ; v5(45.25,8.75) 43.34,8.75 R7.1
SD_CLK: length 52.6
  Inner1 w0.5: v5(20.99,15.1) 16.12,10.23 v1(16.12,8.62)
  Inner2 w0.5: v5(36.36,44.69) 36.36,33.39 26.2,23.23 26.2,16.75 24.55,15.1 v5(20.99,15.1)
  Bottom Layer w0.5: U1.13 v5(36.36,44.69)
  Bottom Layer w0.6: 17.32,8.62 v1(16.12,8.62) 16.12,8.56 14.84,8.56
SD_CMD: length 37.6
  Bottom Layer w0.5: 21.9,40.88 23.41,40.88 24.55,39.74 24.55,30.85 23.28,29.58 23.28,19.8 17.32,13.84 17.32,10.78
  Bottom Layer w0.6: CARD1.3 17.37,10.78
SD_DAT0: length 51.6
  Inner1 w0.5: 16.11,6.35 18.21,6.35 23.15,11.29 v5(23.15,15.86) ; v5(23.92,42.15) 19.22,42.15 18.2,41.14 18.2,22.34 v5(21.38,19.17)
  Inner2 w0.5: v5(23.15,15.86) 21.38,17.64 v5(21.38,19.17)
  Bottom Layer w0.5: U1.24 v5(23.92,42.15)
  Bottom Layer w0.6: 14.84,6.36 v1(16.11,6.35) 17.32,6.34
SELECT_KEY: length 50.6
  Top Layer w0.6: v1(28.36,21.83) 29,21.83 30.77,20.06 30.77,17.9 31.28,17.39 R2.2
  Bottom Layer w0.5: SW2.2 52.24,41.77 50.71,40.25 50.71,29.33 48.93,27.55 34.08,27.55 v1(28.36,21.83)
  Bottom Layer w0.6: v1(28.36,21.83) 26.28,21.83
TOUCH_SWITCH: length 37
  Top Layer w0.5: v1(13.25,43.42) 3.21,43.42 1.31,41.52 J2.1 1.31,26.41
  Bottom Layer w0.5: v1(13.25,43.42) 14.52,44.69 U1.26
TX: length 75
  Inner2 w0.5: v5(44.62,10.4) 40.81,14.21 20.11,14.21 17.82,16.5 17.82,54.34 18.33,54.85 v5(20.11,54.85)
  Bottom Layer w0.5: R8.1 43.21,10.4 v5(44.62,10.4) ; U1.34 v5(20.11,54.85)
U4_10: length 2.1
  Top Layer w0.28: C2.2 3.6,9.91 U4.10
U4_20: length 2.2
  Top Layer w0.28: C12.1 11.05,9.04 10.69,9.4 U4.20
U7_14: length 27.2
  Top Layer w0.34: v1(10.58,46.73) 8.04,49.27 v1(5.75,49.27)
  Top Layer w0.8: v1(5.75,54.85) v1(5.75,52.82)
  Bottom Layer w0.34: v1(10.58,46.73) 10.03,46.18 U7.14
  Bottom Layer w0.8: v1(5.75,52.82) v1(5.75,49.27) ; v1(5.75,54.85) 5.75,59.55 8.11,61.9 C8.1
U7_16: length 21.9
  Bottom Layer w0.34: C7.1 2.64,54.41 3.21,53.84 11.34,53.84 12.99,52.19 12.99,46.47 11.34,44.82 11.33,43.11
U10_4: length 5.7
  Top Layer w0.6: 37.45,5.83 38.39,5.83 v3(38.9,5.32)
  Bottom Layer w0.6: v3(38.9,5.32) 38.71,5.13 C22.1
UP_KEY: length 49.5
  Top Layer w0.6: R1.1 30.39,15.74 29.76,16.37 29.76,19.29 28.49,20.56 v1(28.36,20.56)
  Bottom Layer w0.5: v1(28.36,20.56) 34.46,26.66 49.32,26.66 51.48,28.82 51.48,37.71 53.04,39.27 SW2.1
  Bottom Layer w0.6: U9.4 v1(28.36,20.56)
USB_DET: length 65.7
  Inner1 w0.5: v5(40.17,16.88) 36.49,13.2 v5(33.57,13.2)
  Inner2 w0.5: v5(40.17,16.88) 55.41,32.12 55.41,49.27 53.63,51.04 v5(41.82,51.04)
  Bottom Layer w0.5: 33.58,12.18 v5(33.57,13.2) ; U1.8 v5(41.82,51.04)
  Bottom Layer w0.6: R20.2 R19.1
V_BATT: length 59.5
  Top Layer w0.6: C19.1 20.8,8.56 20.49,8.88 v3(20.49,11.04) 22.52,9.01 v3(28.74,9.01) ; v1(54.27,11.67) 35.98,11.67 v3(33.31,9.01)
  Top Layer w1.4: 60.62,13.23 60.59,13.2 58.97,13.2 58.21,12.44 58.21,10.02 59.22,9.01 J1.2
  Bottom Layer w0.6: v3(20.49,11.04) U14.5 ; v1(54.27,11.67) 57.44,11.67 59,13.23 SW13.3 ; v3(28.74,9.01) v3(33.31,9.01)
  Bottom Layer w0.8: J1.2 59.09,9.01 R17.2 58.07,8.32 C16.1
V_USB: length 64.3
  Top Layer w0.6: U10.16 40.3,9.64 39.41,10.53 36.11,10.53 33.7,8.12 v3(32.68,8.12) 32.04,8.75 ; 32.04,8.75 30.9,8.75 30.1,9.55 LED1.2 26.71,10.15 v1(26.58,10.02) ; 32.04,8.75 30.01,8.75 29.25,7.99 29.25,3.55 28.49,2.78 25.44,2.78 23.79,1.13 21.25,1.13 20.49,1.89 v3(20.49,2.91) 20.49,4.94 20.8,5.26 C18.1
  Top Layer w0.8: LED2.2 LED1.2
  Bottom Layer w0.3: USBC1.A9 28.35,7.87 26.58,9.64 v1(26.58,10.02) 28.61,7.99 28.61,6.19 USBC1.B4 ; 32.55,8.12 32.81,8.12 33.45,7.47 USBC1.A4 ; USBC1.B9 33.15,7.39 32.68,7.86 v3(32.68,8.12) ; 24.3,9.77 U14.8
  Bottom Layer w0.6: v3(20.49,2.91) U14.4 ; U14.8 24.37,10.02 v1(26.58,10.02) ; 35.08,10.53 35.09,9.51 33.7,8.12 v3(32.68,8.12)

## Copper pours and planes (outline as drawn; the poured copper is in the pictures)
GND on Top Layer: 21.88,60.57 21.88,67.43 0.04,67.43 0.04,-0.01 61.76,-0.01 61.76,67.43 39.92,67.43 39.92,60.57
GND on Bottom Layer: 21.88,60.57 21.88,67.43 0.04,67.43 0.04,-0.01 61.76,-0.01 61.76,67.43 39.92,67.43 39.92,60.57
GND on Inner1: 21.88,60.57 21.88,67.43 0.04,67.43 0.04,-0.01 61.76,-0.01 61.76,67.43 39.92,67.43 39.92,60.57
GND on Inner2: 21.88,60.57 21.88,67.43 0.04,67.43 0.04,-0.01 61.76,-0.01 61.76,67.43 39.92,67.43 39.92,60.57

Small or netless copper shapes (teardrops, artwork), in the pictures only: 115 on Top Layer, 262 on Bottom Layer, 11 on Inner1

## Text on the board
Bottom Silkscreen Layer: -
Top Silkscreen Layer: -
